# Altium project FPGA_AudioMischpult.PrjPcb
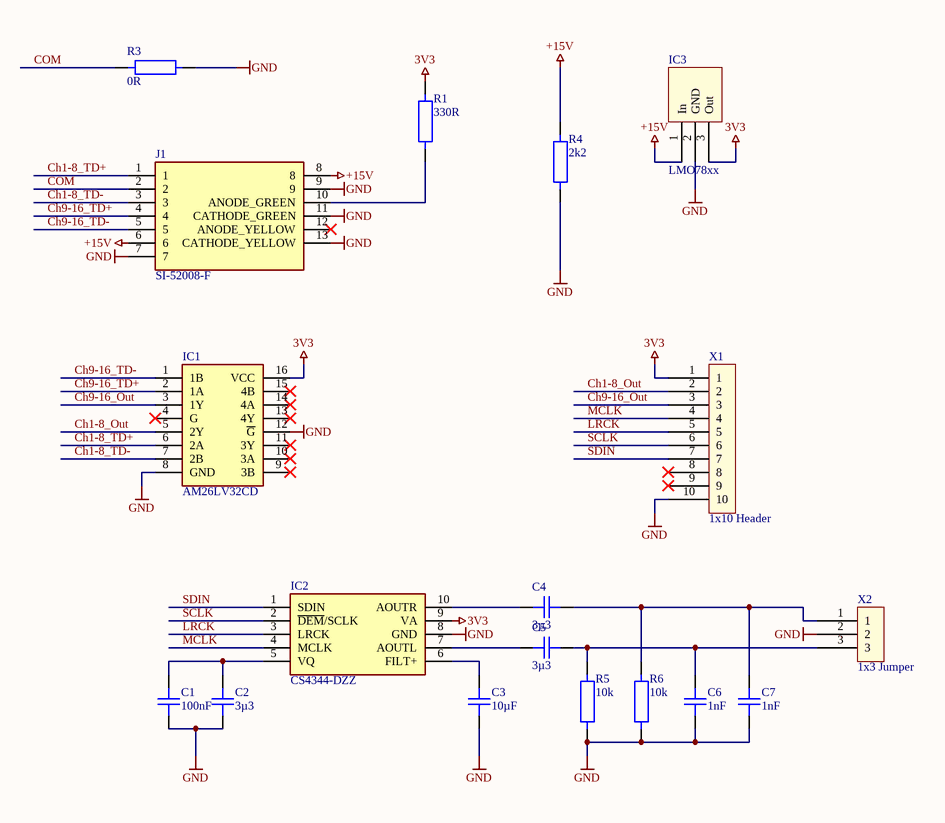
[diagram p0: Main.SchDoc]
1 sheet, 18 parts. Net scope: global (net labels, ports and power ports of the same name join across sheets).
Board file: PCB.PcbDoc

## Sheet Main.SchDoc
size A4; SheetNumber: 1; SheetTotal: 1

### Parts
C1  100nF  [1206]
C2  3µ3  [1206]
C3  10µF  [1206]
C4  3µ3  [1206]
C5  3µ3  [1206]
C6  1nF  [1206]
C7  1nF  [1206]
IC1  AM26LV32CD  [SOIC127P600X175-16N]
IC2  CS4344-DZZ  [SOP50P490X110-10N]
IC3  LMO78xx  [LMO78xx]
J1  SI-52008-F  [SI-52007-F_1]
R1  330R  [1206]
R3  0R  [1206]
R4  2k2  [1206]
R5  10k  [1206]
R6  10k  [1206]
X1  1x10 Header  [1x10 Header]
X2  1x3 Jumper  [1x3 Jumper]

### Nets
3V3: IC1.16(VCC) IC2.9(VA) IC3.3(Out) R1.2 X1.1
+15V: IC3.1(In) J1.6 J1.8 R4.2
GND: C1.1 C2.1 C3.2 C6.1 C7.1 IC1.8(GND) IC1.12(~{G}) IC2.8(GND) IC3.2(GND) J1.7 J1.9 J1.11(CATHODE_GREEN) J1.13(CATHODE_YELLOW) R3.2 R4.1 R5.1 R6.1 X1.10 X2.2
Ch1-8_Out: IC1.5(2Y) X1.2
Ch1-8_TD+: IC1.6(2A) J1.1
Ch1-8_TD-: IC1.7(2B) J1.3
Ch9-16_Out: IC1.3(1Y) X1.3
Ch9-16_TD+: IC1.2(1A) J1.4
Ch9-16_TD-: IC1.1(1B) J1.5
COM: J1.2 R3.1
LRCK: IC2.3(LRCK) X1.5
MCLK: IC2.4(MCLK) X1.4
SCLK: IC2.2(~{DEM}/SCLK) X1.6
SDIN: IC2.1(SDIN) X1.7
NetC1_2: C1.2 C2.2 IC2.5(VQ)
NetC3_1: C3.1 IC2.6(FILT+)
NetC4_1: C4.1 IC2.10(AOUTR)
NetC4_2: C4.2 C7.2 R6.2 X2.1
NetC5_1: C5.1 IC2.7(AOUTL)
NetC5_2: C5.2 C6.2 R5.2 X2.3
NetJ1_10: J1.10(ANODE_GREEN) R1.1

Not connected (* = marked no-connect by the designer): IC1 4(G)* 9(3B)* 10(3A)* 11(3Y)* 13(4Y)* 14(4A)* 15(4B)*; J1 12(ANODE_YELLOW)*; X1 8* 9*

### Library data of the parts
C1-C7 = 1206_C_1nF/63V: 1206_C; Text Field1: 06-23225; SMA-ArtikelNr: *
IC1 = AM26LV32CD: Low-Voltage High-Speed Quadruple Differential Line Receiver; Manufacturer_Name: Texas Instruments; Geometry.Height: 1.75mm; Mouser Part Number: 595-AM26LV32CD; Mouser Price/Stock: https://www.mouser.co.uk/ProductDetail/Texas-Instruments/AM26LV32CD?qs=OorDGPQ79Er6PFoDaOtIRQ%3D%3D; Manufacturer_Part_Number: AM26LV32CD; Datasheet Link: http://www.ti.com/lit/ds/symlink/am26lv32.pdf
IC2 = CS4344-DZZ: Audio D/A Converter ICs Stereo DAC 24-Bit 192kHz; Manufacturer_Name: Cirrus Logic; Geometry.Height: 1.1mm; Mouser Part Number: 777-CS4344-DZZ; Mouser Price/Stock: https://www.mouser.co.uk/ProductDetail/Cirrus-Logic/CS4344-DZZ?qs=bUPhaerQQeHBMG5ERFq6kw%3D%3D; Manufacturer_Part_Number: CS4344-DZZ; Datasheet Link: https://statics.cirrus.com/pubs/proDatasheet/CS4344-45-48_F2.pdf
J1 = SI-52008-F: Magjack 10BASE T POE with LEDS Bel-Stewart RJ Socket Module, STP, Straight; Manufacturer_Name: BelFuse; Mouser Part Number: 530-SI-52008-F; Mouser Price/Stock: https://www.mouser.com/Search/Refine.aspx?Keyword=530-SI-52008-F; Manufacturer_Part_Number: SI-52008-F; Datasheet Link: https://componentsearchengine.com/Datasheets/1/SI-52008-F.pdf
R1 R3-R6 = 1206_R: SMA-ArtikelNr: *